# EAGLE schematic ACS713-SOIC8 (EAGLE 8.1.1)
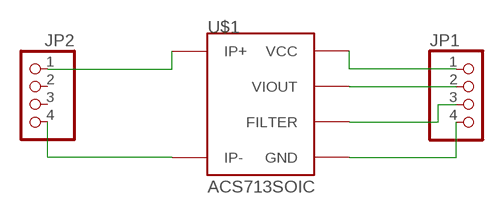
[diagram p0: schematic, sheet 1]

## Parts
JP1  PINHD-1X4  [1X04]
JP2  PINHD-1X4  [1X04]
U$1  ACS713SOIC  [ACS713-SOIC]

## Nets
N$1: JP2.1 U$1.P$1(IP+) U$1.P$2(IP+)
N$2: JP2.4 U$1.P$3(IP-) U$1.P$4(IP-)
N$3: JP1.4 U$1.P$5(GND)
N$4: JP1.3 U$1.P$6(FILTER)
N$5: JP1.2 U$1.P$7(VIOUT)
N$6: JP1.1 U$1.P$8(VCC)
Unconnected: JP2.2 JP2.3

## Library data of the parts
JP1 JP2 = pinhead:PINHD-1X4: PIN HEADER
U$1 = allegro:ACS713